# Altium project obc-comm.PrjPcb (part 2 of 2)

## Sheet eps_bt1.SchDoc
size A
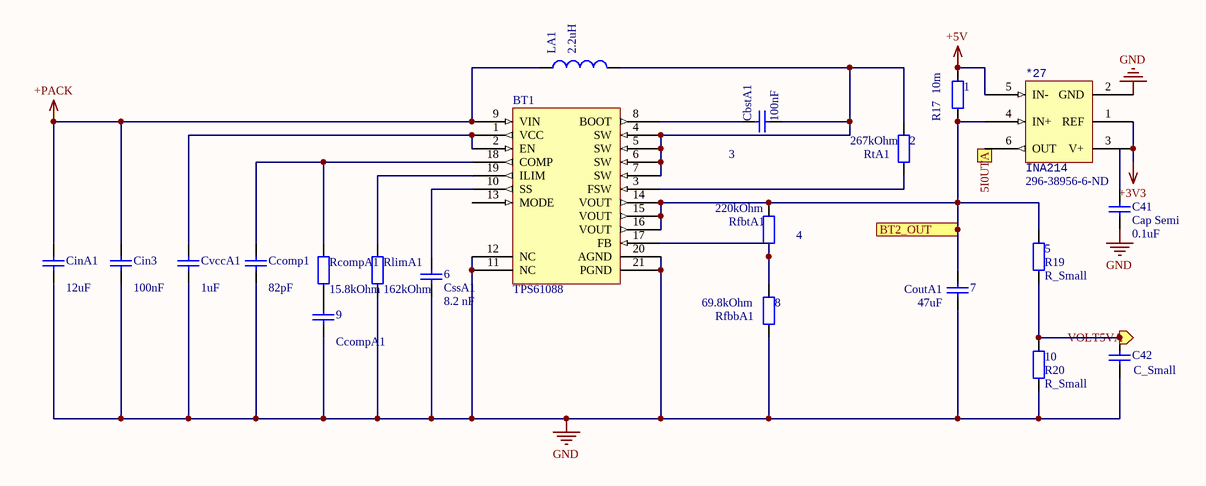
[diagram p16: eps_bt1.SchDoc]

### Parts
(Parts that share a designator on the sheet are numbered #1, #2 ... from top to bottom, then left to right.)
1  R17  value 10m  [1608[0603]]
2  RtA1  value 267kOhm  [1608[0603]]
3  CbstA1  value 100nF  [1608[0603]]
4  RfbtA1  value 220kOhm  [1608[0603]]
5  R19  value R_Small  [1608[0603]]
6  CssA1  value 8.2 nF  [1608[0603]]
7  CoutA1  value 47uF  [1608[0603]]
8  RfbbA1  value 69.8kOhm  [1608[0603]]
9  value CcompA1  [1608[0603]]
10  R20  value R_Small  [1608[0603]]
*27#2  INA214  Supplier Part Number 1: 296-38956-6-ND  [SOT65P210X110-6N]
BT1  TPS61088  [QFN50P450X350X100-21N]
C41  Cap Semi  value 0.1uF  [1608[0603]]
C42  value C_Small  [1608[0603]]
Ccomp1  value 82pF  [1608[0603]]
Cin3  value 100nF  [1608[0603]]
CinA1  value 12uF  [1608[0603]]
CvccA1  value 1uF  [1608[0603]]
LA1  value 2.2uH  [1608[0603]]
RcompA1  value 15.8kOhm  [1608[0603]]
RlimA1  value 162kOhm  [1608[0603]]

### Ports
5I0UTA (out), BT2_OUT (in), VOLT5VA (out)

### Nets
+3V3: *27#2.1(REF) *27#2.3(V+)
+5V: 1.2 *27#2.5(IN-)
+PACK: BT1.9(VIN) Cin3.2 CinA1.2 LA1.1
GND: 6.1 7.1 8.1 9.1 10.1 *27#2.2(GND) BT1.11(NC) BT1.12(NC) BT1.20(AGND) BT1.21(PGND) C41.1 C42.2 Ccomp1.1 Cin3.1 CinA1.1 CvccA1.1 RlimA1.1
Net1_1: 1.1 4.2 5.2 7.2 *27#2.4(IN+) BT1.14(VOUT) BT1.15(VOUT) BT1.16(VOUT) ; port BT2_OUT
Net2_1: 2.1 3.1 BT1.4(SW) BT1.5(SW) BT1.6(SW) BT1.7(SW) LA1.2
Net2_2: 2.2 BT1.3(FSW)
Net3_2: 3.2 BT1.8(BOOT)
Net4_1: 4.1 8.2 BT1.17(FB)
Net5_1: 5.1 10.2 C42.1 ; port VOLT5VA
Net6_2: 6.2 BT1.10(SS)
Net9_2: 9.2 RcompA1.1
Net*2_14: *27#2.6(OUT) ; port 5I0UTA
NetBT1_1: BT1.1(VCC) BT1.2(EN) CvccA1.2
NetBT1_18: BT1.18(COMP) Ccomp1.2 RcompA1.2
NetBT1_19: BT1.19(ILIM) RlimA1.2

Not connected (* = marked no-connect by the designer): BT1 13(MODE); C41 2

### Library data of the parts
1 2 4 5 8 10 RcompA1 RlimA1 = Res2: Resistor; Published: 8-Jun-2000; LatestRevisionDate: 17-Jul-2002; LatestRevisionNote: Re-released for DXP Platform.; PackageReference: AXIAL-0.4; Publisher: Altium Limited; PackageDescription: Axial Device, Thru-Hole; 2 Leads; 0.4 in Pin Spacing
3 6 7 9 C42 Ccomp1 Cin3 CinA1 CvccA1 = Cap: Capacitor; Published: 8-Jun-2000; LatestRevisionDate: 17-Jul-2002; LatestRevisionNote: Re-released for DXP Platform.; PackageReference: RAD-0.3; Publisher: Altium Limited; PackageDescription: Radial Cap, Thru-Hole; 2 Leads; 0.3 in Pin Spacing
*27#2 = INA214: Current monitor; Supplier 1: Digi-Key
BT1 = TPS61088: Boost converter
C41 = Cap Semi: Capacitor (Semiconductor SIM Model); Published: 8-Jun-2000; LatestRevisionDate: 29-May-2009; LatestRevisionNote: IPC-7351 Footprint Added.; PackageReference: C1206; Publisher: Altium Limited; PackageDescription: Chip Capacitor
LA1 = Inductor: Code_IEC: 1005; Published: 8-Jun-2000; LatestRevisionDate: 29-May-2009; LatestRevisionNote: IPC-7351 Footprint Added.; PackageReference: 0402-A; Publisher: Altium Limited; PackageDescription: Chip Inductor; Code_JEITA: 0402

## Sheet eps_bt2.SchDoc
size A4
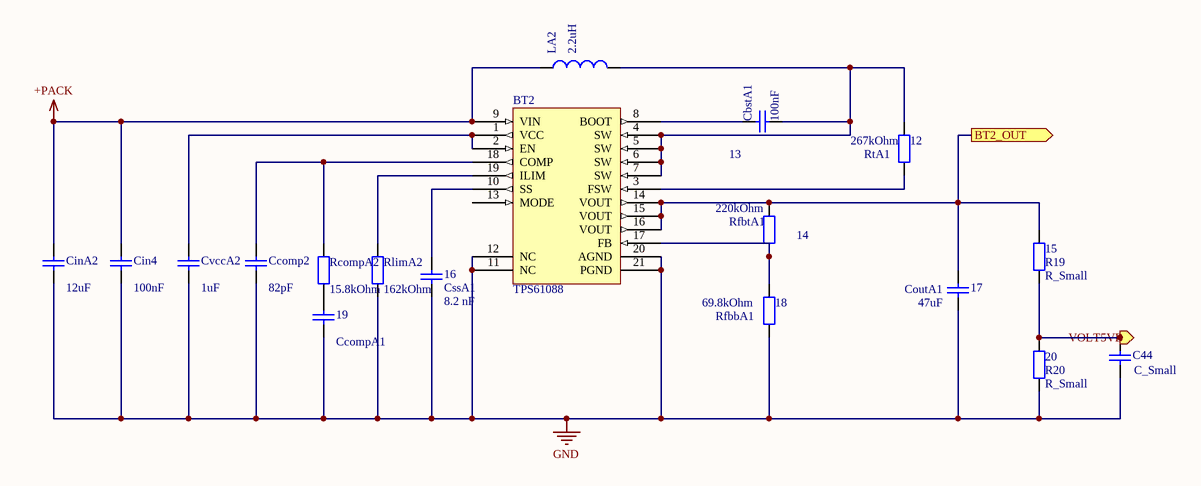
[diagram p17: eps_bt2.SchDoc]

### Parts
12  RtA1  value 267kOhm  [1608[0603]]
13  CbstA1  value 100nF  [1608[0603]]
14  RfbtA1  value 220kOhm  [1608[0603]]
15  R19  value R_Small  [1608[0603]]
16  CssA1  value 8.2 nF  [1608[0603]]
17  CoutA1  value 47uF  [1608[0603]]
18  RfbbA1  value 69.8kOhm  [1608[0603]]
19  value CcompA1  [1608[0603]]
20  R20  value R_Small  [1608[0603]]
BT2  TPS61088  [QFN50P450X350X100-21N]
C44  value C_Small  [1608[0603]]
Ccomp2  value 82pF  [1608[0603]]
Cin4  value 100nF  [1608[0603]]
CinA2  value 12uF  [1608[0603]]
CvccA2  value 1uF  [1608[0603]]
LA2  value 2.2uH  [1608[0603]]
RcompA2  value 15.8kOhm  [1608[0603]]
RlimA2  value 162kOhm  [1608[0603]]

### Ports
BT2_OUT (out), VOLT5VB (out)

### Nets
+PACK: BT2.9(VIN) Cin4.2 CinA2.2 LA2.1
GND: 16.1 17.1 18.1 19.1 20.1 BT2.11(NC) BT2.12(NC) BT2.20(AGND) BT2.21(PGND) C44.2 Ccomp2.1 Cin4.1 CinA2.1 CvccA2.1 RlimA2.1
Net1_1: 14.2 15.2 17.2 BT2.14(VOUT) BT2.15(VOUT) BT2.16(VOUT) ; port BT2_OUT
Net5_1: 15.1 20.2 C44.1 ; port VOLT5VB
Net12_1: 12.1 13.1 BT2.4(SW) BT2.5(SW) BT2.6(SW) BT2.7(SW) LA2.2
Net12_2: 12.2 BT2.3(FSW)
Net13_2: 13.2 BT2.8(BOOT)
Net14_1: 14.1 18.2 BT2.17(FB)
Net16_2: 16.2 BT2.10(SS)
Net19_2: 19.2 RcompA2.1
NetBT2_1: BT2.1(VCC) BT2.2(EN) CvccA2.2
NetBT2_18: BT2.18(COMP) Ccomp2.2 RcompA2.2
NetBT2_19: BT2.19(ILIM) RlimA2.2

Not connected (* = marked no-connect by the designer): BT2 13(MODE)

### Library data of the parts
12 14 15 18 20 RcompA2 RlimA2 = Res2: Resistor; Published: 8-Jun-2000; LatestRevisionDate: 17-Jul-2002; LatestRevisionNote: Re-released for DXP Platform.; PackageReference: AXIAL-0.4; Publisher: Altium Limited; PackageDescription: Axial Device, Thru-Hole; 2 Leads; 0.4 in Pin Spacing
13 16 17 19 C44 Ccomp2 Cin4 CinA2 CvccA2 = Cap: Capacitor; Published: 8-Jun-2000; LatestRevisionDate: 17-Jul-2002; LatestRevisionNote: Re-released for DXP Platform.; PackageReference: RAD-0.3; Publisher: Altium Limited; PackageDescription: Radial Cap, Thru-Hole; 2 Leads; 0.3 in Pin Spacing
BT2 = TPS61088: Boost converter
LA2 = Inductor: Code_IEC: 1005; Published: 8-Jun-2000; LatestRevisionDate: 29-May-2009; LatestRevisionNote: IPC-7351 Footprint Added.; PackageReference: 0402-A; Publisher: Altium Limited; PackageDescription: Chip Inductor; Code_JEITA: 0402

## Sheet eps_batt.SchDoc
size A4
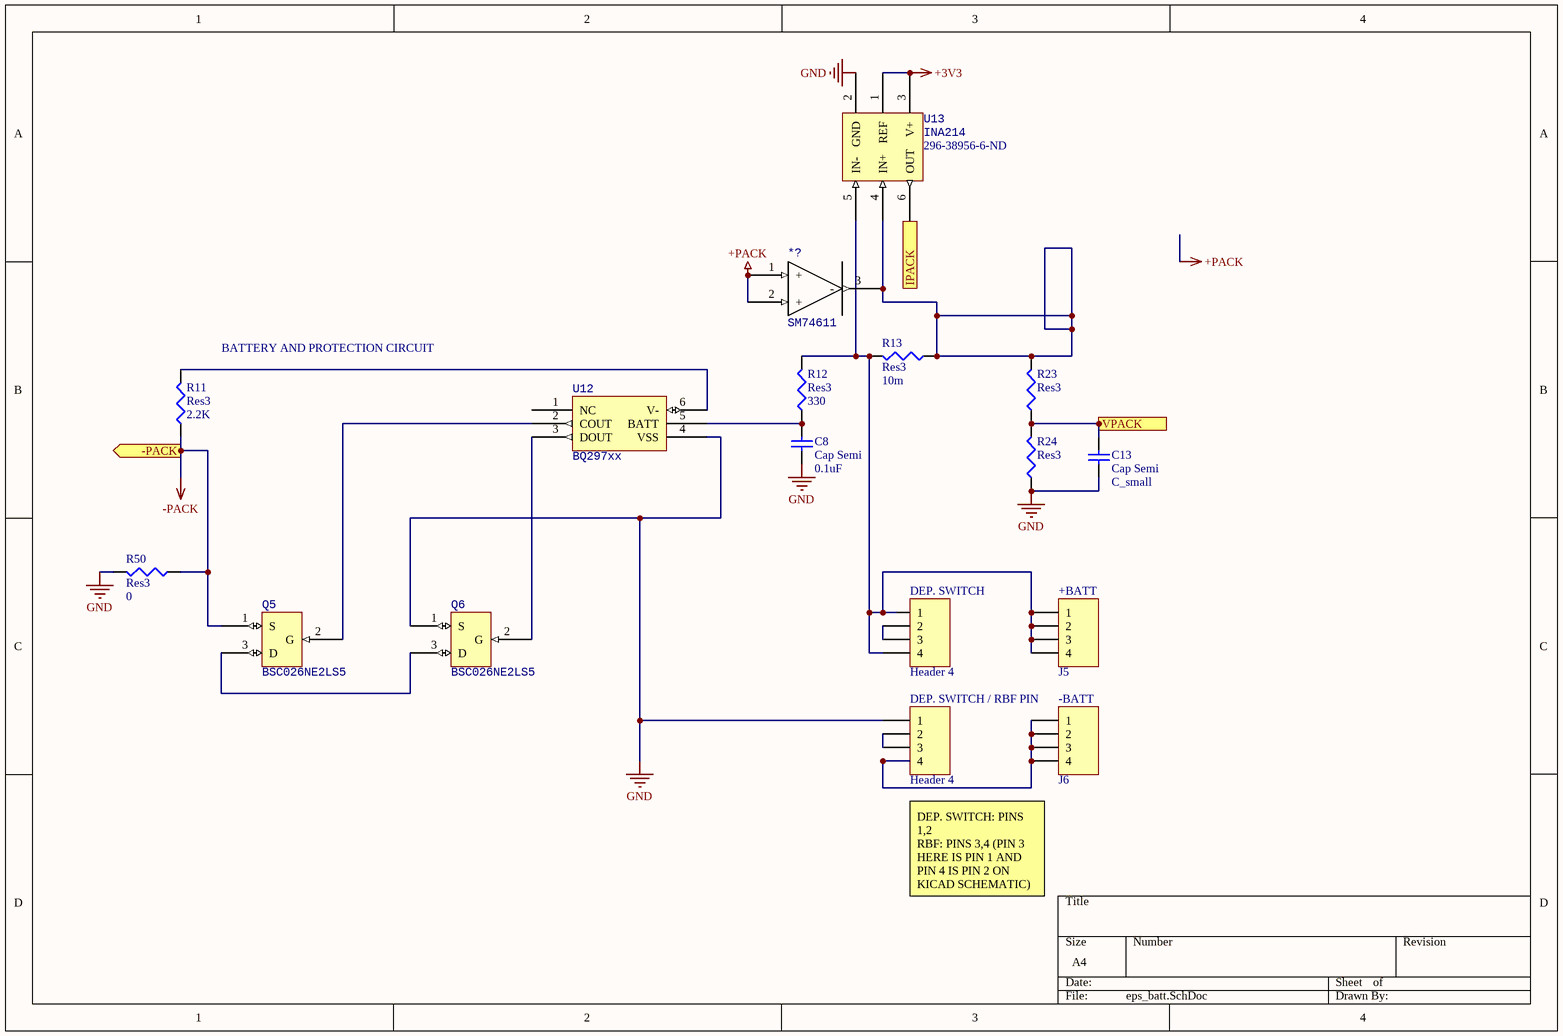
[diagram p18: eps_batt.SchDoc]

### Parts
(Parts that share a designator on the sheet are numbered #1, #2 ... from top to bottom, then left to right.)
*?  SM74611  [TO254P1435X464-3N]
+BATT  J5  [DF14-4P-1.25H(55)]
-BATT  J6  [DF14-4P-1.25H(55)]
C8#2  Cap Semi  value 0.1uF  [1608[0603]]
C13#2  Cap Semi  value C_small  [1608[0603]]
DEP._SWITCH  Header 4  [DF14-4P-1.25H(55)]
DEP._SWITCH_/_RBF_PIN  Header 4  [DF14-4P-1.25H(55)]
Q5  BSC026NE2LS5  [INF-PG-TDSON-8-1_V]
Q6  BSC026NE2LS5  [INF-PG-TDSON-8-1_V]
R11#2  Res3  value 2.2K  [J1-0603]
R12#2  Res3  value 330  [J1-0603]
R13#2  Res3  value 10m  [J1-0603]
R23#2  Res3  [J1-0603]
R24#2  Res3  [J1-0603]
R50  Res3  value 0  [J1-0603]
U12  BQ297xx  [SON50P150X150X80-6N - duplicate1]
U13  INA214  Supplier Part Number 1: 296-38956-6-ND  [SOT65P210X110-6N]

### Ports
-PACK (out), IPACK (out), VPACK (in)

### Nets
+3V3: U13.1(REF) U13.3(V+)
+PACK: *?.1(+) *?.2(+)
-PACK: Q5.1(S) R11#2.1 R50.1 ; port -PACK
GND: C8#2.1 C13#2.1 DEP._SWITCH_/_RBF_PIN.1 Q6.1(S) R24#2.1 R50.2 U12.4(VSS) U13.2(GND)
Net*2_7: U13.6(OUT) ; port IPACK
Net*2_8: C13#2.2 R23#2.1 R24#2.2 ; port VPACK
Net*?_3: *?.3(-) R13#2.1 R23#2.2 U13.4(IN+)
Net+BATT_1: +BATT.1 +BATT.2 +BATT.3 +BATT.4 DEP._SWITCH.1 DEP._SWITCH.4 R12#2.2 R13#2.2 U13.5(IN-)
Net-BATT_1: -BATT.1 -BATT.2 -BATT.3 -BATT.4 DEP._SWITCH_/_RBF_PIN.4
NetC8#2_2: C8#2.2 R12#2.1 U12.5(BATT)
NetDEP._SWITCH_2: DEP._SWITCH.2 DEP._SWITCH.3
NetDEP._SWITCH_/_RBF_PIN_2: DEP._SWITCH_/_RBF_PIN.2 DEP._SWITCH_/_RBF_PIN.3
NetQ5_2: Q5.2(G) U12.2(COUT)
NetQ5_3: Q5.3(D) Q6.3(D)
NetQ6_2: Q6.2(G) U12.3(DOUT)
NetR11#2_2: R11#2.2 U12.6(V-)

Not connected (* = marked no-connect by the designer): U12 1(NC)

### Notes on the sheet
- (near R11#2) BATTERY AND PROTECTION CIRCUIT
- DEP. SWITCH: PINS 1,2
  RBF: PINS 3,4 (PIN 3 HERE IS PIN 1 AND PIN 4 IS PIN 2 ON KICAD SCHEMATIC)

### Library data of the parts
*? = SM74611: PV Diode
+BATT -BATT DEP._SWITCH DEP._SWITCH_/_RBF_PIN = Header 4: Header, 4-Pin; LatestRevisionDate: 17-Jul-2002; LatestRevisionNote: Re-released for DXP Platform.; Publisher: Altium Limited; ComponentLink1Description: Hirose DF14-4P-1.25H(55) Right Angle; ComponentLink1URL: https://www.digikey.ca/product-detail/en/hirose-electric-co-ltd/DF14-4P-1.25H-55/H10317-ND/964472
C8#2 C13#2 = Cap Semi: Capacitor (Semiconductor SIM Model); Published: 8-Jun-2000; LatestRevisionDate: 29-May-2009; LatestRevisionNote: IPC-7351 Footprint Added.; PackageReference: C1206; Publisher: Altium Limited; PackageDescription: Chip Capacitor
Q5 Q6 = BSC026NE2LS5: MOSFET; ComponentLink1Description: N-Channel Mosfet; ComponentLink1URL: https://www.digikey.ca/product-detail/en/infineon-technologies/BSC026NE2LS5ATMA1/BSC026NE2LS5ATMA1DKR-ND/6564538
R11#2 R12#2 R13#2 R23#2 R24#2 R50 = Res3: Resistor; Published: 8-Jun-2000; LatestRevisionDate: 29-May-2009; LatestRevisionNote: IPC-7351 Footprint Added.; PackageReference: J1-0603; Publisher: Altium Limited; PackageDescription: Chip Resistor
U12 = BQ2972: Battery protection; ComponentLink1Description: Charge Controller; ComponentLink1URL: https://www.digikey.com/product-detail/en/texas-instruments/BQ29729DSET/296-44131-1-ND/6005144
U13 = INA214: Current monitor; Supplier 1: Digi-Key; ComponentLink1Description: IC Current Monitor; ComponentLink1URL: https://www.digikey.ca/product-detail/en/texas-instruments/INA214AIDCKR/296-38956-1-ND/5143051

## Nets that join several sheets
+3V3: bus-main (J1.14 P5.2), obc_32m1 (13 pins), obc_can_transceiver (C31.2 C32.2 U6.3), U_obc_main_3/U_obc_flash (C35#1.1 OBC-MEM3.3 OBC-MEM3.7 OBC-MEM3.8), obc_rtc (U10.4 U10.6), U_obc_main_3/U_obc_flash (C35#2.1 OBC-MEM2.3 OBC-MEM2.7 OBC-MEM2.8), U_obc_main_3/U_obc_flash (C35#3.1 OBC-MEM1.3 OBC-MEM1.7 OBC-MEM1.8), eps_32m1 (13 pins), eps_can_transceiver (C36.2 C37.2 U8.3), eps_flash (C40.1 U9.3 U9.7 U9.8), eps_pex (C21#2.2 R10.1 U3.9), eps_adc (6 pins), eps_bb1 (6 pins), eps_bb2 (6 pins), eps_pv (8 pins), eps_bt1 (*27#2.1 *27#2.3), eps_batt (U13.1 U13.3)
+5V: bus-main (6 pins), eps_pv (*14.4 *22.4), eps_bt1 (1.2 *27#2.5)
+PACK: bus-main (J1.18), eps_bb1 (6 pins), eps_bb2 (6 pins), eps_pv (*29.3), eps_bt1 (BT1.9 Cin3.2 CinA1.2 LA1.1), eps_bt2 (BT2.9 Cin4.2 CinA2.2 LA2.1), eps_batt (*?.1 *?.2)
-PACK: eps_adc (*2.13 C16.1), eps_batt (Q5.1 R11#2.1 R50.1)
GND: bus-main (9 pins), obc_32m1 (12 pins), obc_can_transceiver (6 pins), U_obc_main_3/U_obc_flash (C35#1.2 OBC-MEM3.4 R33_U_obc_main_3_U_obc_flash#1.2), obc_rtc (11 pins), U_obc_main_3/U_obc_flash (C35#2.2 OBC-MEM2.4 R33.2), U_obc_main_3/U_obc_flash (C35#3.2 OBC-MEM1.4 R33_U_obc_main_3_U_obc_flash#2.2), eps_32m1 (12 pins), eps_can_transceiver (6 pins), eps_flash (C40.2 U9.4), eps_pex (5 pins), eps_adc (22 pins), eps_bb1 (11 pins), eps_bb2 (11 pins), eps_pv (18 pins), eps_bt1 (17 pins), eps_bt2 (15 pins), eps_batt (8 pins)
CANH: bus-main (J1.16 P5.8), obc_can_transceiver (R31.1 U6.7), eps_can_transceiver (R43#1.1 U8.7)
CANL: bus-main (J1.17 P5.9), obc_can_transceiver (R28.1 U6.6), eps_can_transceiver (R40#1.1 U8.6)
EPS_MISO_A: bus-main (J1.2 P5.5), obc_32m1 (P1.1 U1.1 U2.3), eps_32m1 (P6.1 U4.1)
EPS_MOSI_A: bus-main (J1.3), eps_32m1 (5 pins)
EPS_SCK_A: bus-main (J1.4), eps_32m1 (P6.3 S?#3.1)
MOSI_A: bus-main (J1.7 P3.1 P3.2), obc_32m1 (5 pins)
Net1_1: eps_bt1 (8 pins), eps_bt2 (6 pins)
Net5_1: eps_adc (*2.15 C12.1), eps_bt1 (5.1 10.2 C42.1), eps_bt2 (15.1 20.2 C44.1)
Net*2_7: eps_adc (*2.7 C5.1), eps_batt (U13.6)
Net*2_8: eps_adc (*2.8 C7.1), eps_batt (C13#2.2 R23#2.1 R24#2.2)
Net*2_9: eps_adc (*2.9 C9.1), eps_pv (*22.14)
Net*2_10: eps_adc (*2.10 C11.1), eps_pv (*22.8)
Net*2_11: eps_adc (*2.11 C13#1.1), eps_pv (*22.7)
Net*2_12: eps_adc (*2.12 C15.1), eps_pv (*22.1)
Net*2_14: eps_adc (*2.14 C14.1), eps_bt1 (*27#2.6)
Net*2_16: eps_adc (*2.16 C10.1), eps_bb2 (*4#2.6)
Net*2_17: eps_adc (*2.17 C8#1.1), eps_bb1 (*3#2.6)
Net*2_18: eps_adc (*2.18 C6.1), eps_bb1 (C27#2.2 R21.2 R22.1), eps_bb2 (C29.2 R24#1.2 R25#2.1)
Net*2_23: eps_32m1 (U4.23), eps_adc (*2.23)
Net*2_24: eps_32m1 (U4.28), eps_flash (U9.6), eps_pex (U3.12), eps_adc (*2.24)
Net*2_25: eps_32m1 (U4.9), eps_flash (U9.5), eps_pex (U3.13), eps_adc (*2.25)
Net*2_26: eps_32m1 (U4.8), eps_flash (U9.2), eps_pex (U3.14), eps_adc (*2.26)
Net*14_3: eps_pex (U3.21), eps_pv (*14.3)
Net*14_5: eps_pex (U3.22), eps_pv (*14.5)
Net*14_10: eps_pex (U3.23), eps_pv (*14.10)
Net*14_12: eps_pex (U3.24), eps_pv (*14.12)
NetOBC-MEM1_1: obc_32m1 (U1.24), U_obc_main_3/U_obc_flash (OBC-MEM1.1 R33_U_obc_main_3_U_obc_flash#2.1)
NetOBC-MEM1_2: obc_32m1 (U1.8), U_obc_main_3/U_obc_flash (OBC-MEM3.2), obc_rtc (U10.19), U_obc_main_3/U_obc_flash (OBC-MEM2.2), U_obc_main_3/U_obc_flash (OBC-MEM1.2)
NetOBC-MEM1_5: obc_32m1 (U1.9), U_obc_main_3/U_obc_flash (OBC-MEM3.5), obc_rtc (U10.17), U_obc_main_3/U_obc_flash (OBC-MEM2.5), U_obc_main_3/U_obc_flash (OBC-MEM1.5)
NetOBC-MEM1_6: obc_32m1 (U1.28), U_obc_main_3/U_obc_flash (OBC-MEM3.6), obc_rtc (U10.18 U10.20), U_obc_main_3/U_obc_flash (OBC-MEM2.6), U_obc_main_3/U_obc_flash (OBC-MEM1.6)
NetOBC-MEM2_1: obc_32m1 (U1.23), U_obc_main_3/U_obc_flash (OBC-MEM2.1 R33.1)
NetOBC-MEM3_1: obc_32m1 (U1.16), U_obc_main_3/U_obc_flash (OBC-MEM3.1 R33_U_obc_main_3_U_obc_flash#1.1)
NetR8_2: obc_main_3.0 (R8.2), obc_32m1 (U1.17)
NetR9_2: obc_main_3.0 (R9.2), obc_32m1 (U1.18)
NetR10_2: eps_32m1 (U4.32), eps_pex (R10.2 U3.18)
NetR25#1_2: eps_digital (R25#1.2), eps_32m1 (U4.18)
NetR26#1_2: eps_digital (R26#1.2), eps_32m1 (U4.22)
NetR30_2: obc_32m1 (U1.30), obc_can_transceiver (R30.2)
NetR39_2: eps_32m1 (U4.7 U5.9), eps_can_transceiver (R39.2)
NetR41#1_2: eps_32m1 (U4.6 U5.5), eps_can_transceiver (R41#1.2)
NetR42#1_2: eps_32m1 (U4.30), eps_can_transceiver (R42#1.2)
NetU1_26: obc_32m1 (U1.26), obc_rtc (U10.1)
NetU3_11: eps_32m1 (U4.3), eps_pex (U3.11)
NetU4_16: eps_32m1 (U4.16), eps_flash (U9.1)
OBC_RX: bus-main (P3.3 P3.4), obc_32m1 (P2.1 P2.3 S?#2.3)
OBC_SCK_A: bus-main (J1.8), obc_32m1 (P1.3 S?#2.1)
RST: bus-main (J1.9), obc_32m1 (S?#2.5 U1.31 U2.11), eps_digital (R26#1.1)
RST_EPS: bus-main (J1.5), obc_main_3.0 (R8.1), eps_32m1 (S?#3.5 U4.31 U5.11)
RST_PAY: bus-main (J1.15 P5.6), obc_main_3.0 (R9.1), eps_digital (R25#1.1)
RXCAN: obc_32m1 (U1.7 U2.9), obc_can_transceiver (R27.2)
TXCAN: obc_32m1 (U1.6 U2.5), obc_can_transceiver (R29.2)